# EAGLE schematic Arduinoboy (EAGLE 9.6.2)
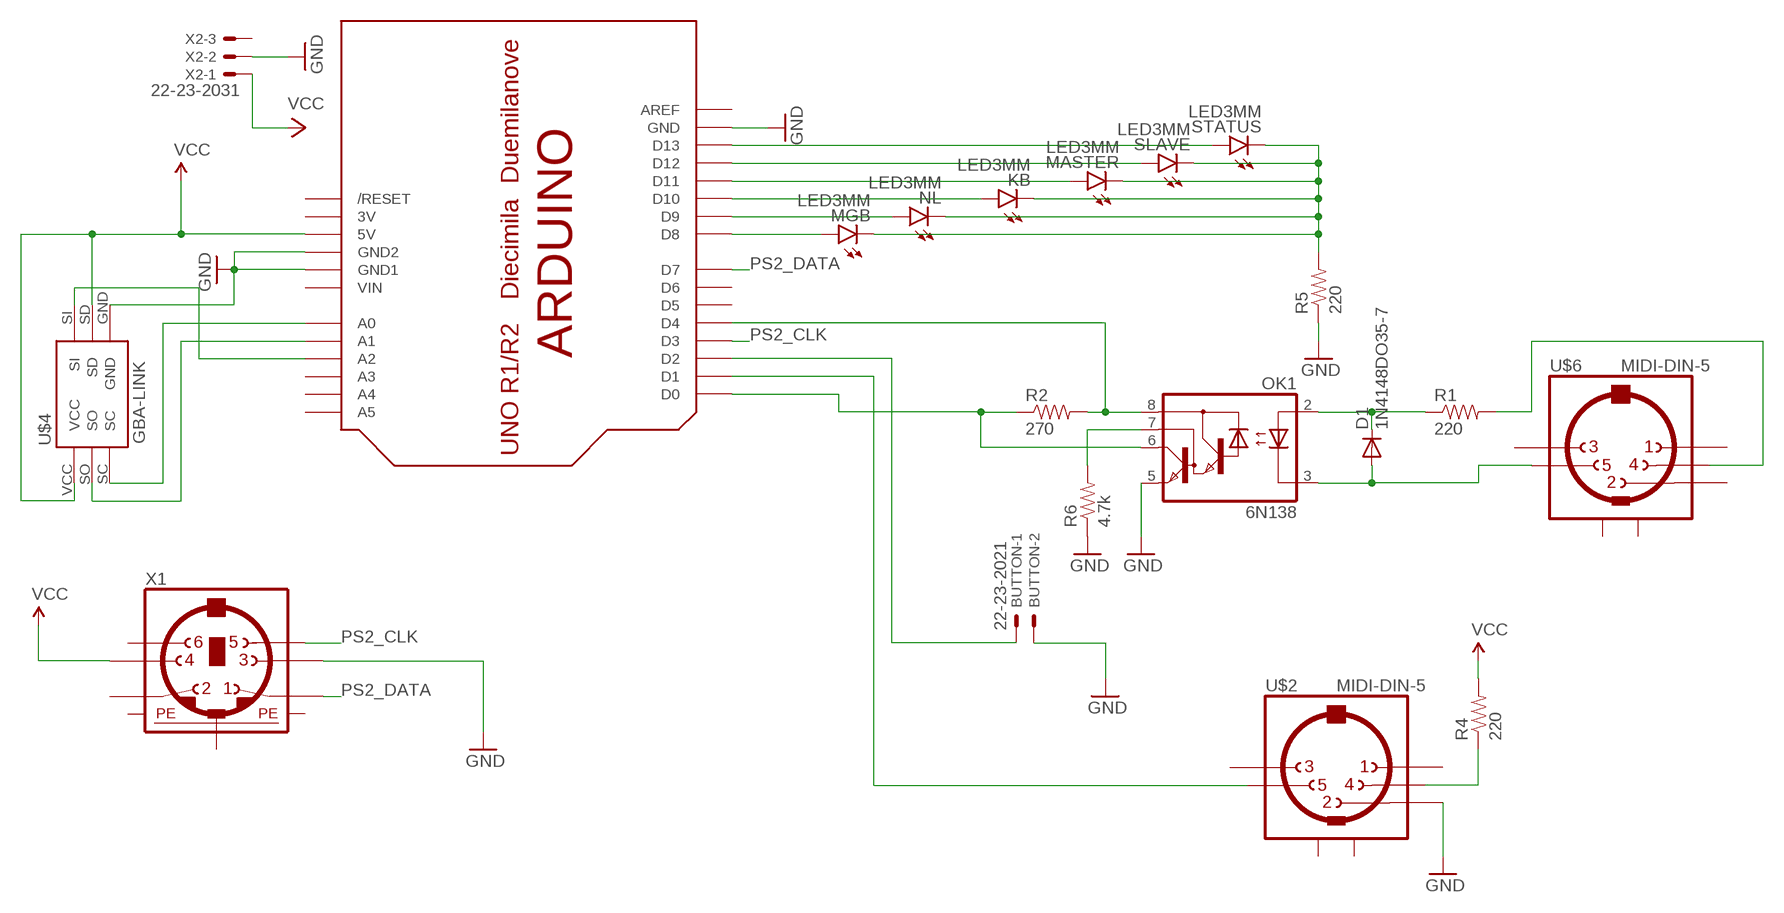
[diagram p0: schematic, sheet 1]

## Parts
BUTTON  22-23-2021  [22-23-2021]
D1  1N4148DO35-7  [DO35-7]
KB  LED3MM  [LED3MM]
MASTER  LED3MM  [LED3MM]
MGB  LED3MM  [LED3MM]
NL  LED3MM  [LED3MM]
OK1  6N138  [DIL08]
R1  220  RESISTORAXIAL-0.3  [AXIAL-0.3]
R2  270  RESISTORAXIAL-0.3  [AXIAL-0.3]
R4  220  RESISTORAXIAL-0.3  [AXIAL-0.3]
R5  220  RESISTORAXIAL-0.3  [AXIAL-0.3]
R6  4.7k  RESISTORAXIAL-0.3  [AXIAL-0.3]
SLAVE  LED3MM  [LED3MM]
STATUS  LED3MM  [LED3MM]
U$2  MIDI-DIN-5  [MIDI-DIN-5]
U$3  ARDUINOUNO  [ARDUINO]
U$4  GBA-LINK  [GBA-LINK]
U$6  MIDI-DIN-5  [MIDI-DIN-5]
X1  MINI_DIN_6  [M_DIN6]
X2  22-23-2031  [22-23-2031]

## Nets
GND: BUTTON.2 OK1.5(GND) R5.P$1 R6.P$1 U$2.2 U$3.GND U$3.GND1 U$3.GND2 U$4.GND X1.3 X2.2
N$1: D1.C OK1.2(A) R1.P$1
N$2: D1.A OK1.3(C) U$6.5
N$5: R4.P$1 U$2.4
N$6: MGB.A U$3.D8
N$7: U$2.5 U$3.D1
N$8: NL.A U$3.D9
N$9: OK1.8(VCC) R2.P$2 U$3.D4
N$10: OK1.6(VO) R2.P$1 U$3.D0
N$11: KB.A U$3.D10
N$12: MASTER.A U$3.D11
N$13: SLAVE.A U$3.D12
N$14: STATUS.A U$3.D13
N$15: KB.K(C) MASTER.K(C) MGB.K(C) NL.K(C) R5.P$2 SLAVE.K(C) STATUS.K(C)
N$16: OK1.7(VB) R6.P$2
N$17: U$3.A0 U$4.SC
N$19: R1.P$2 U$6.4
N$20: BUTTON.1 U$3.D2
N$21: U$3.A1 U$4.SO
N$22: U$3.A2 U$4.SI
PS2_CLK: U$3.D3 X1.5
PS2_DATA: U$3.D7 X1.1
VCC: R4.P$2 U$3.5V U$4.SD U$4.VCC X1.4 X2.1
Unconnected: U$2.1 U$2.3 U$2.PE1 U$2.PE2 U$2.PE11(PE1) U$2.PE22(PE2) U$3.A3 U$3.A4 U$3.A5 U$3.AREF U$3.D5 U$3.D6 U$3.RESET(/RESET) U$4.S$1 U$4.S$2(S$1) U$6.1 U$6.2 U$6.3 U$6.PE1 U$6.PE2 U$6.PE11(PE1) U$6.PE22(PE2) X1.2 X1.6 X2.3

## Power pins joined to a net without a drawn wire
3V: U$3.3V
PE1: X1.SH1(PE1)
PE2: X1.SH2(PE2)
PE3: X1.SH3(PE3)
VIN: U$3.VIN

## Library data of the parts
BUTTON = con-molex:22-23-2021: .100" (2.54mm) Center Header - 2 Pin; MF: MOLEX; MPN: 22-23-2021; OC_FARNELL: 1462926; OC_NEWARK: 25C3832
D1 = diode:1N4148: DIODE high speed (Philips)
KB MASTER MGB NL SLAVE STATUS = gm-diodes:LED
OK1 = optocoupler:6N138: MOTOROLA OPTO COUPLER
R1 R2 R4-R6 = SparkFun-Resistors:RESISTOR: Resistor Basic schematic elements and footprints for 0603, 1206, and PTH resistors.
U$2 U$6 = MIDI by Jazz:MIDI-DIN-5
U$3 = arduino uno pin only:ARDUINO: Arduino Diecimila/Duemilanove Make a shield with ease, this package has all the named pins as well as the two mounting drill holes and an outline of the USB and DC power connector. The outline is on the DIMENSION layer, so if your board house uses it they will cut the outline to match. http://www.ladyada.net/library/pcb/eaglelibrary.html
U$4 = Catskulls_link_port:GBA-LINK
X1 = mini_din:MINI_DIN_6
X2 = con-molex:22-23-2031: .100" (2.54mm) Center Header - 3 Pin; MF: MOLEX; MPN: 22-23-2031; OC_FARNELL: 1462950; OC_NEWARK: 30C0862

## Net classes
0 default: width 0.889 mm, clearance 0.381 mm